# EAGLE schematic nav (EAGLE 8.2.0)
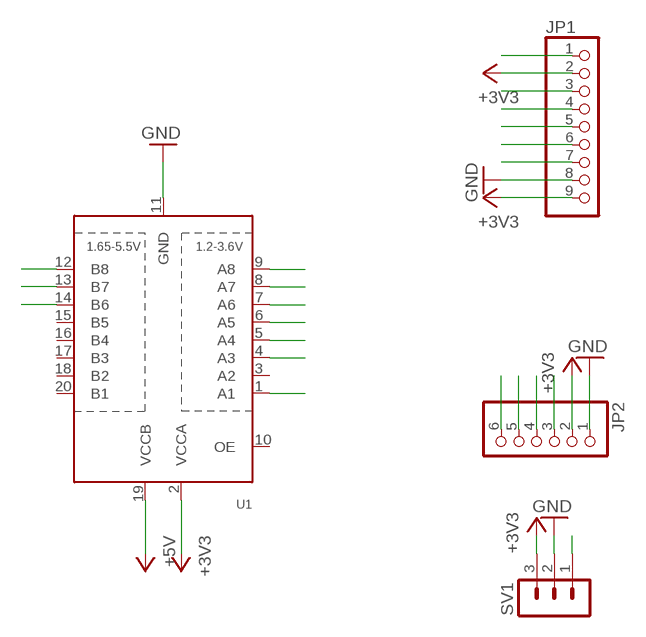
[diagram p0: schematic, sheet 1]

## Parts
JP1  PINHD-1X9  [1X09-BIG]
JP2  PINHD-1X6  [1X06]
SV1  MA03-1  [MA03-1]
U1  TXB0108PWR  [TSSOP20]

## Nets
+3V3: JP1.2 JP1.9 JP2.2 SV1.3 U1.2(VCCA)
+5V: U1.19(VCCB)
GND: JP1.8 JP2.1 SV1.2 U1.11(GND)
GPS_RX: SV1.1
MISO3: JP1.1 JP2.3 U1.9(A8)
MISO5: U1.12(B8)
MOSI3: JP1.4 JP2.4 U1.8(A7)
MOSI5: U1.13(B7)
SCK3: JP1.3 JP2.5 U1.7(A6)
SCK5: U1.14(B6)
SCREEN_CS: JP1.7 U1.4(A3)
SCREEN_DC: JP1.5 U1.6(A5)
SCREEN_RESET: JP1.6 U1.5(A4)
SD_CS: JP2.6 U1.1(A1)
Unconnected: U1.3(A2) U1.10(OE) U1.15(B5) U1.16(B4) U1.17(B3) U1.18(B2) U1.20(B1)

## Library data of the parts
JP1 = adafruit:PINHD-1X9: Pin header 1x10 0.1" spacing With round pins; OC_NEWARK: unknown
JP2 = adafruit:PINHD-1X6: PIN HEADER; OC_NEWARK: unknown
SV1 = con-lstb:MA03-1: PIN HEADER; OC_FARNELL: unknown; OC_NEWARK: unknown
U1 = adafruit:TXB0108PWR: 8-Bit Bi-Directional Level Shifter 1.2V-3.6V (VCCA) to 1.65V-5.5V (VCCB) bi-directional level shifter with auto direction sensing. Max data rate - VCCA 1.8V: 20Mbps (50ns), VCCA 3.3V: 100Mbps (10ns) Digikey: 296-21527-1-ND; OC_NEWARK: unknown